# Altium project dv_spectrum_row.PrjPcb
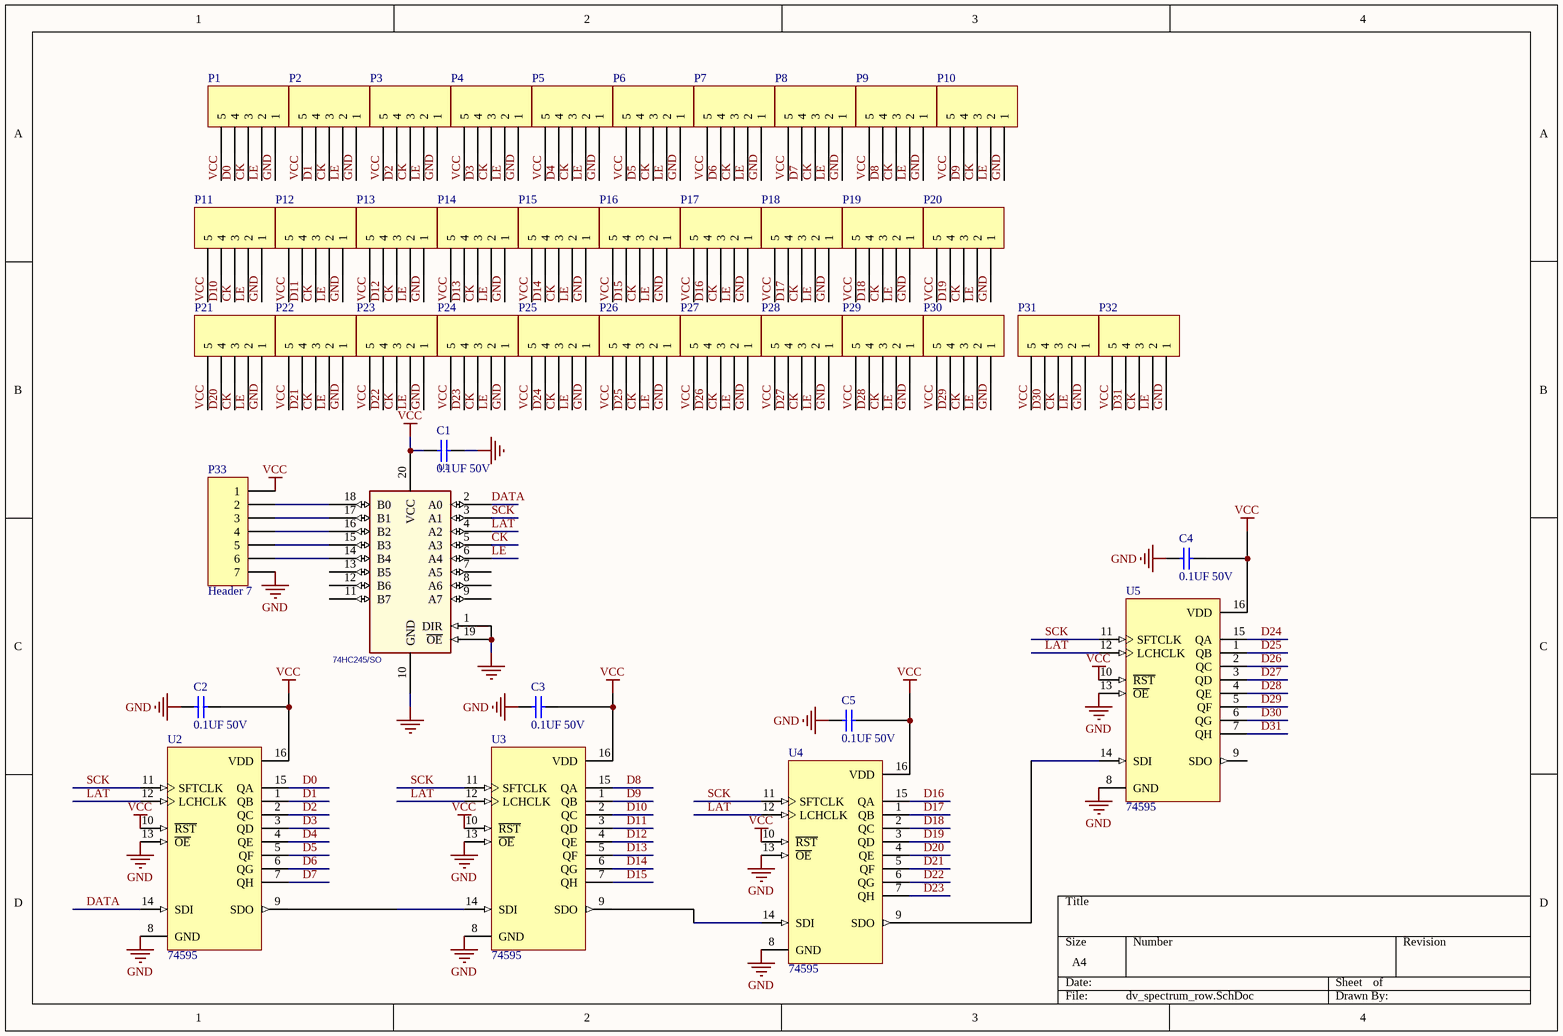
[diagram p0: dv_spectrum_row.SchDoc]
1 sheet, 43 parts. Net scope: global (net labels, ports and power ports of the same name join across sheets).
Board file: dv_spectrum_row.PcbDoc

## Sheet dv_spectrum_row.SchDoc
size A4

### Parts
C1  0.1UF 50V  [CAPC2012X135N]
C2  0.1UF 50V  [CAPC2012X135N]
C3  0.1UF 50V  [CAPC2012X135N]
C4  0.1UF 50V  [CAPC2012X135N]
C5  0.1UF 50V  [CAPC2012X135N]
P1  Header 5  [HDR1X5]  (value not drawn)
P2  Header 5  [HDR1X5]  (value not drawn)
P3  Header 5  [HDR1X5]  (value not drawn)
P4  Header 5  [HDR1X5]  (value not drawn)
P5  Header 5  [HDR1X5]  (value not drawn)
P6  Header 5  [HDR1X5]  (value not drawn)
P7  Header 5  [HDR1X5]  (value not drawn)
P8  Header 5  [HDR1X5]  (value not drawn)
P9  Header 5  [HDR1X5]  (value not drawn)
P10  Header 5  [HDR1X5]  (value not drawn)
P11  Header 5  [HDR1X5]  (value not drawn)
P12  Header 5  [HDR1X5]  (value not drawn)
P13  Header 5  [HDR1X5]  (value not drawn)
P14  Header 5  [HDR1X5]  (value not drawn)
P15  Header 5  [HDR1X5]  (value not drawn)
P16  Header 5  [HDR1X5]  (value not drawn)
P17  Header 5  [HDR1X5]  (value not drawn)
P18  Header 5  [HDR1X5]  (value not drawn)
P19  Header 5  [HDR1X5]  (value not drawn)
P20  Header 5  [HDR1X5]  (value not drawn)
P21  Header 5  [HDR1X5]  (value not drawn)
P22  Header 5  [HDR1X5]  (value not drawn)
P23  Header 5  [HDR1X5]  (value not drawn)
P24  Header 5  [HDR1X5]  (value not drawn)
P25  Header 5  [HDR1X5]  (value not drawn)
P26  Header 5  [HDR1X5]  (value not drawn)
P27  Header 5  [HDR1X5]  (value not drawn)
P28  Header 5  [HDR1X5]  (value not drawn)
P29  Header 5  [HDR1X5]  (value not drawn)
P30  Header 5  [HDR1X5]  (value not drawn)
P31  Header 5  [HDR1X5]  (value not drawn)
P32  Header 5  [HDR1X5]  (value not drawn)
P33  Header 7  [HDR1X7]
U1  74HC245/SO  [SO20-150mil]
U2  74595  [SO16-150mil]
U3  74595  [SO16-150mil]
U4  74595  [SO16-150mil]
U5  74595  [SO16-150mil]

### Nets
GND: C1.1 C2.1 C3.2 C4.2 C5.2 P1.1 P2.1 P3.1 P4.1 P5.1 P6.1 P7.1 P8.1 P9.1 P10.1 P11.1 P12.1 P13.1 P14.1 P15.1 P16.1 P17.1 P18.1 P19.1 P20.1 P21.1 P22.1 P23.1 P24.1 P25.1 P26.1 P27.1 P28.1 P29.1 P30.1 P31.1 P32.1 P33.7 U1.1(DIR) U1.10(GND) U1.19(~{OE}) U2.8(GND) U2.13(~{OE}) U3.8(GND) U3.13(~{OE}) U4.8(GND) U4.13(~{OE}) U5.8(GND) U5.13(~{OE})
VCC: C1.2 C2.2 C3.1 C4.1 C5.1 P1.5 P2.5 P3.5 P4.5 P5.5 P6.5 P7.5 P8.5 P9.5 P10.5 P11.5 P12.5 P13.5 P14.5 P15.5 P16.5 P17.5 P18.5 P19.5 P20.5 P21.5 P22.5 P23.5 P24.5 P25.5 P26.5 P27.5 P28.5 P29.5 P30.5 P31.5 P32.5 P33.1 U1.20(VCC) U2.10(~{RST}) U2.16(VDD) U3.10(~{RST}) U3.16(VDD) U4.10(~{RST}) U4.16(VDD) U5.10(~{RST}) U5.16(VDD)
CK: P1.3 P2.3 P3.3 P4.3 P5.3 P6.3 P7.3 P8.3 P9.3 P10.3 P11.3 P12.3 P13.3 P14.3 P15.3 P16.3 P17.3 P18.3 P19.3 P20.3 P21.3 P22.3 P23.3 P24.3 P25.3 P26.3 P27.3 P28.3 P29.3 P30.3 P31.3 P32.3 U1.5(A3)
D0: P1.4 U2.15(QA)
D1: P2.4 U2.1(QB)
D2: P3.4 U2.2(QC)
D3: P4.4 U2.3(QD)
D4: P5.4 U2.4(QE)
D5: P6.4 U2.5(QF)
D6: P7.4 U2.6(QG)
D7: P8.4 U2.7(QH)
D8: P9.4 U3.15(QA)
D9: P10.4 U3.1(QB)
D10: P11.4 U3.2(QC)
D11: P12.4 U3.3(QD)
D12: P13.4 U3.4(QE)
D13: P14.4 U3.5(QF)
D14: P15.4 U3.6(QG)
D15: P16.4 U3.7(QH)
D16: P17.4 U4.15(QA)
D17: P18.4 U4.1(QB)
D18: P19.4 U4.2(QC)
D19: P20.4 U4.3(QD)
D20: P21.4 U4.4(QE)
D21: P22.4 U4.5(QF)
D22: P23.4 U4.6(QG)
D23: P24.4 U4.7(QH)
D24: P25.4 U5.15(QA)
D25: P26.4 U5.1(QB)
D26: P27.4 U5.2(QC)
D27: P28.4 U5.3(QD)
D28: P29.4 U5.4(QE)
D29: P30.4 U5.5(QF)
D30: P31.4 U5.6(QG)
D31: P32.4 U5.7(QH)
DATA: U1.2(A0) U2.14(SDI)
LAT: U1.4(A2) U2.12(LCHCLK) U3.12(LCHCLK) U4.12(LCHCLK) U5.12(LCHCLK)
LE: P1.2 P2.2 P3.2 P4.2 P5.2 P6.2 P7.2 P8.2 P9.2 P10.2 P11.2 P12.2 P13.2 P14.2 P15.2 P16.2 P17.2 P18.2 P19.2 P20.2 P21.2 P22.2 P23.2 P24.2 P25.2 P26.2 P27.2 P28.2 P29.2 P30.2 P31.2 P32.2 U1.6(A4)
SCK: U1.3(A1) U2.11(SFTCLK) U3.11(SFTCLK) U4.11(SFTCLK) U5.11(SFTCLK)
NetP33_2: P33.2 U1.18(B0)
NetP33_3: P33.3 U1.17(B1)
NetP33_4: P33.4 U1.16(B2)
NetP33_5: P33.5 U1.15(B3)
NetP33_6: P33.6 U1.14(B4)
NetU2_9: U2.9(SDO) U3.14(SDI)
NetU3_9: U3.9(SDO) U4.14(SDI)
NetU4_9: U4.9(SDO) U5.14(SDI)

Not connected (* = marked no-connect by the designer): U1 7(A5) 8(A6) 9(A7) 11(B7) 12(B6) 13(B5); U5 9(SDO)

### Library data of the parts
C1-C5 = CC0805ZRY5V9BB104: CAP CER 0.1UF 50V Y5V 0805; Manufacturer: Yageo; Capacitance: 0.1µF; Tolerance: -20%, +80%; Temperature Coefficient: Y5V (F); Supplier 1: Digi-Key; Supplier Part Number 1: 311-1361-2-ND; Manufacturer Part Number: CC0805ZRY5V9BB104; RoHS: RoHS Compliant; Category: Capacitors; Stock 1: 412000; Pricing 1: 4000=0.00589, 8000=0.00538, 12000=0.00512, 28000=0.00486, 100000=0.00352 (USD); Packaging: Tape & Reel (TR); Voltage - Rated: 50V; Mounting Type: Surface Mount, MLCC; Operating Temperature: -30°C ~ 85°C; Applications: General Purpose; Ratings: -; Package / Case: 0805 (2012 Metric); Size / Dimension: 0.079" L x 0.049" W (2.00mm x 1.25mm); Height - Seated (Max): -; Thickness (Max): 0.024" (0.60mm); Lead Spacing: -; Features: -; Lead Style: -; ComponentLink1URL: http://www.yageo.com/documents/recent/UPY-GPHC_Y5V_6.3V-to-50V_5.pdf; ComponentLink1Description: http://www.yageo.com/documents/recent/UPY-GPHC_Y5V_6.3V-to-50V_5.pdf
P1-P32 = Header 5: Header, 5-Pin; LatestRevisionDate: 17-Jul-2002; LatestRevisionNote: Re-released for DXP Platform.; Publisher: Altium Limited
P33 = Header 7: Header, 7-Pin; LatestRevisionDate: 17-Jul-2002; LatestRevisionNote: Re-released for DXP Platform.; Publisher: Altium Limited
U1 = 74HC245/SO_1
U2-U5 = 74595: 8-Bit Serial-Input/Serial or Prallel-Output Shift Register with Latched 3-State Outputs; Published: 15-Apr-2002; DatasheetVersion: Mar-2000; PackageVersion: Apr-2000; PackageReference: 648-08; Publisher: Altium Limited; PackageDescription: DIP; 16 Leads; Row Spacing 7.62 mm; Pitch 2.54 mm; Code_JEDEC: MS-001-BB; ComponentLink1Description: Manufacturer Link; ComponentLink1URL: http://www.onsemi.com/; ComponentLink2Description: Datasheet; ComponentLink2URL: http://www.onsemi.com/pub/Collateral/MC74HC595A-D.PDF